# EAGLE design PSE project (EAGLE 9.6.2)
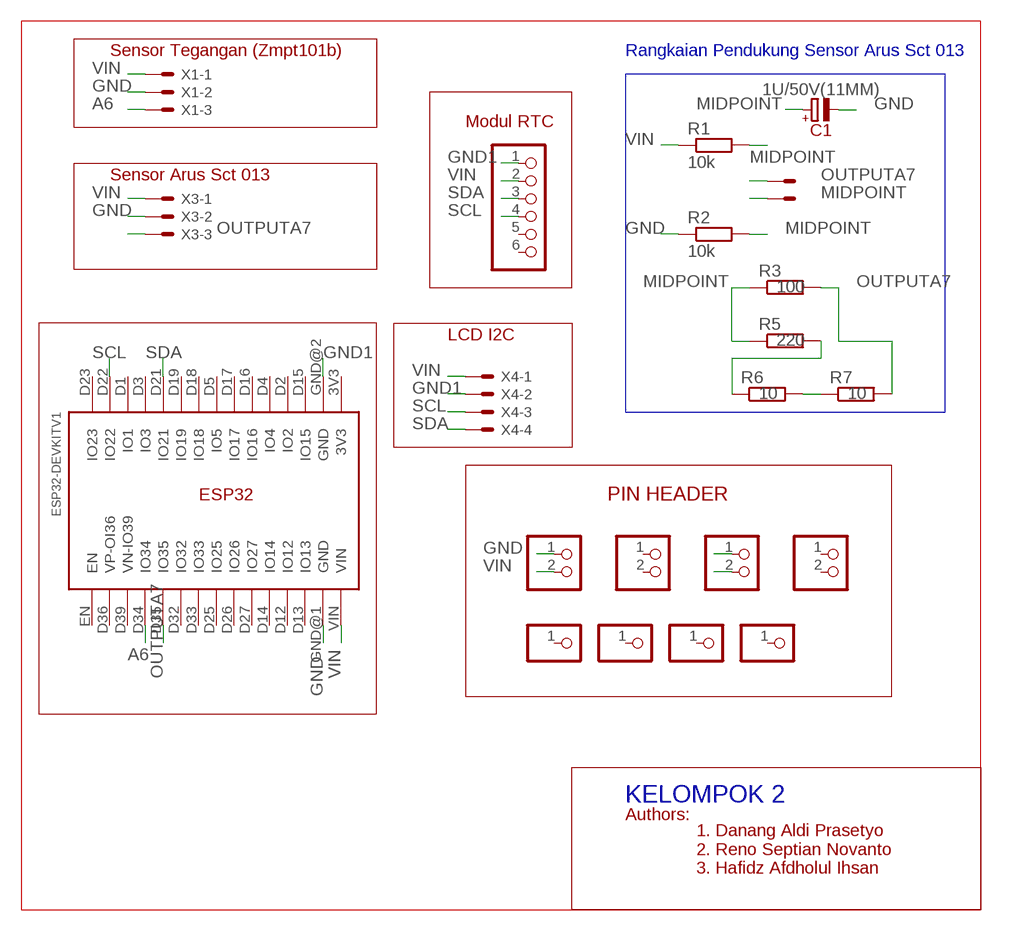
[diagram p0: schematic, sheet 1]

## Parts
C1  1U/50V(11MM)  [E2-5]
JP1  PINHD-1X2  [1X02]
JP2  PINHD-1X2  [1X02]
JP3  PINHD-1X2  [1X02]
JP4  PINHD-1X2  [1X02]
JP5  PINHD-1X6  [1X06]
JP6  PINHD-1X1  [1X01]
JP7  PINHD-1X1  [1X01]
JP8  PINHD-1X1  [1X01]
JP9  PINHD-1X1  [1X01]
R1  10k  R-EU_0204/5  [0204/5]
R2  10k  R-EU_0204/5  [0204/5]
R3  100  R-EU_0204/5  [0204/5]
R5  220  R-EU_0204/5  [0204/5]
R6  10  R-EU_0204/5  [0204/5]
R7  10  R-EU_0204/5  [0204/5]
U$1  ESP32DEVKITV1  [ESP32-DEVKITV1]
X1  JST-XH-03-PIN-LONG-PAD  [JST-XH-03-PACKAGE-LONG-PAD]
X3  JST-XH-03-PIN-LONG-PAD  [JST-XH-03-PACKAGE-LONG-PAD]
X4  JST-XH-04-PIN-LONG-PAD  [JST-XH-04-PACKAGE-LONG-PAD]
X7  JST-XH-02-PIN-LONG-PAD  [JST-XH-02-PACKAGE-LONG-PAD]

## Nets
A6: U$1.D34(IO34) X1.3
GND: C1.- JP1.1 R2.1 U$1.GND@1(GND) X1.2 X3.2
GND1: JP5.1 U$1.GND@2(GND) X4.2
MIDPOINT: C1.+ R1.2 R2.2 R3.1 R5.1 X7.2
N$1: R6.2 R7.1
N$2: R5.2 R6.1
N$16: JP2.1
N$17: JP2.2
OUTPUTA7: R3.2 R7.2 U$1.D35(IO35) X3.3 X7.1
SCL: JP5.4 U$1.D22(IO22) X4.3
SDA: JP5.3 U$1.D21(IO21) X4.4
VIN: JP1.2 JP5.2 R1.1 U$1.VIN X1.1 X3.1 X4.1
Unconnected: JP3.1 JP3.2 JP4.1 JP4.2 JP5.5 JP5.6 JP6.1 JP7.1 JP8.1 JP9.1 U$1.3V3 U$1.D1(IO1) U$1.D2(IO2) U$1.D3(IO3) U$1.D4(IO4) U$1.D5(IO5) U$1.D12(IO12) U$1.D13(IO13) U$1.D14(IO14) U$1.D15(IO15) U$1.D16(IO16) U$1.D17(IO17) U$1.D18(IO18) U$1.D19(IO19) U$1.D23(IO23) U$1.D25(IO25) U$1.D26(IO26) U$1.D27(IO27) U$1.D32(IO32) U$1.D33(IO33) U$1.D36(VP-OI36) U$1.D39(VN-IO39) U$1.EN

## Buses
B$1

## Notes on the sheet
- Sensor Tegangan (Zmpt101b) | Rangkaian Pendukung Sensor Arus Sct 013
- Modul RTC
- Sensor Arus Sct 013
- LCD I2C
- ESP32 | PIN HEADER
- KELOMPOK 2
- Authors:
- 1. Danang Aldi Prasetyo
  2. Reno Septian Novanto
  3. Hafidz Afdholul Ihsan

## Library data of the parts
C1 = capacitor:?; MOUSER: 647-UKW1H010MDD
JP1-JP4 = pinhead:PINHD-1X2: PIN HEADER
JP5 = pinhead:PINHD-1X6: PIN HEADER
JP6-JP9 = pinhead:PINHD-1X1: PIN HEADER
R1-R3 R5-R7 = resistor:R-EU_: RESISTOR, European symbol
U$1 = ESP32-DEVKITV1:ESP32DEVKITV1
X1 X3 = Rembrandt Electronics - JST XH Connectors v1-0:JST-XH-03-PIN: JST XH Connector 2 Pin Wire to board connector. Pitch: 2,54 mm, (0.100") Number of pins: 3 Created by Rembrandt Electronics www.rembrandtelectronics.com
X4 = Rembrandt Electronics - JST XH Connectors v1-0:JST-XH-04-PIN: JST XH Connector 2 Pin Wire to board connector. Pitch: 2,54 mm, (0.100") Number of pins: 4 Created by Rembrandt Electronics www.rembrandtelectronics.com
X7 = Rembrandt Electronics - JST XH Connectors v1-0:JST-XH-02-PIN: JST XH Connector 2 Pin Wire to board connector. Pitch: 2,54 mm, (0.100") Number of pins: 2 Created by Rembrandt Electronics www.rembrandtelectronics.com

## Board
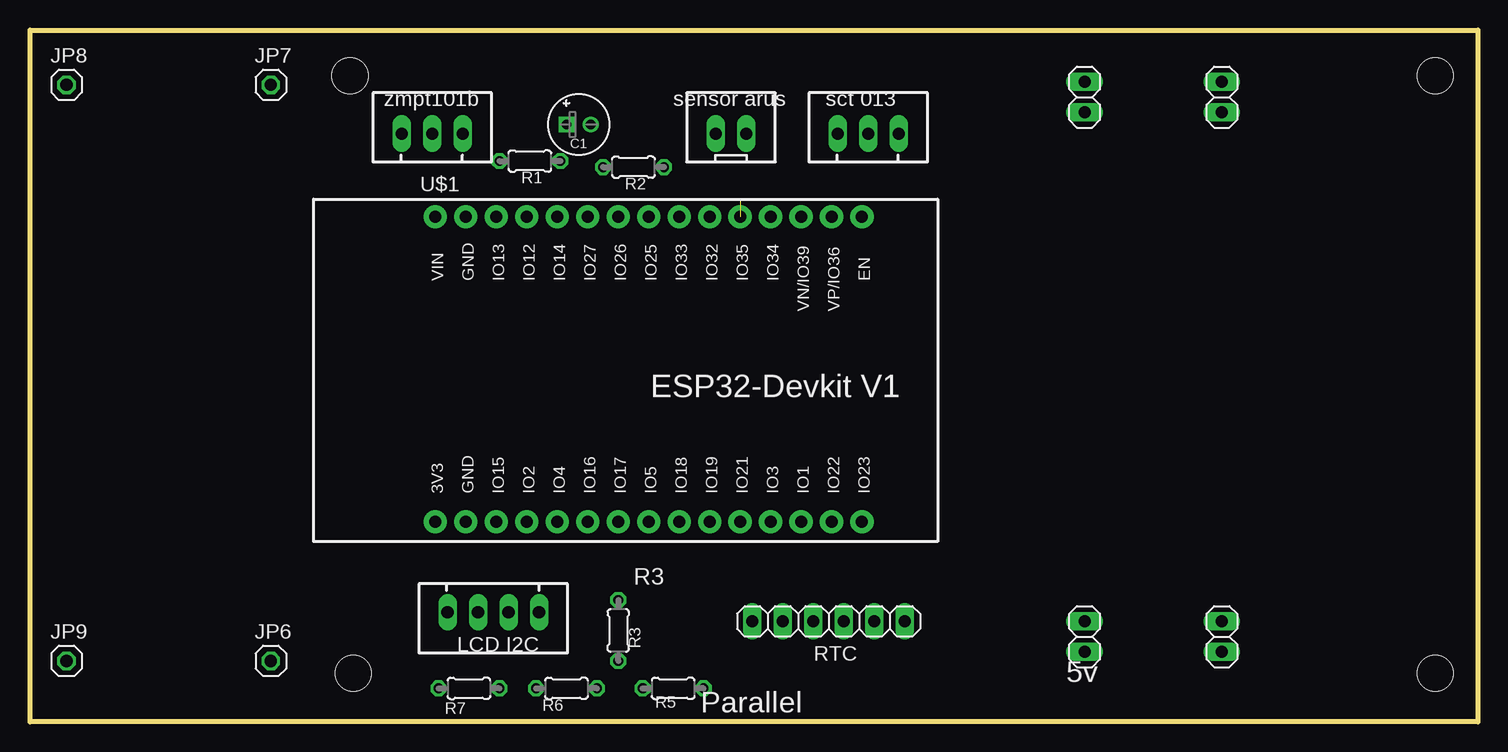
[diagram p1: board, top side]
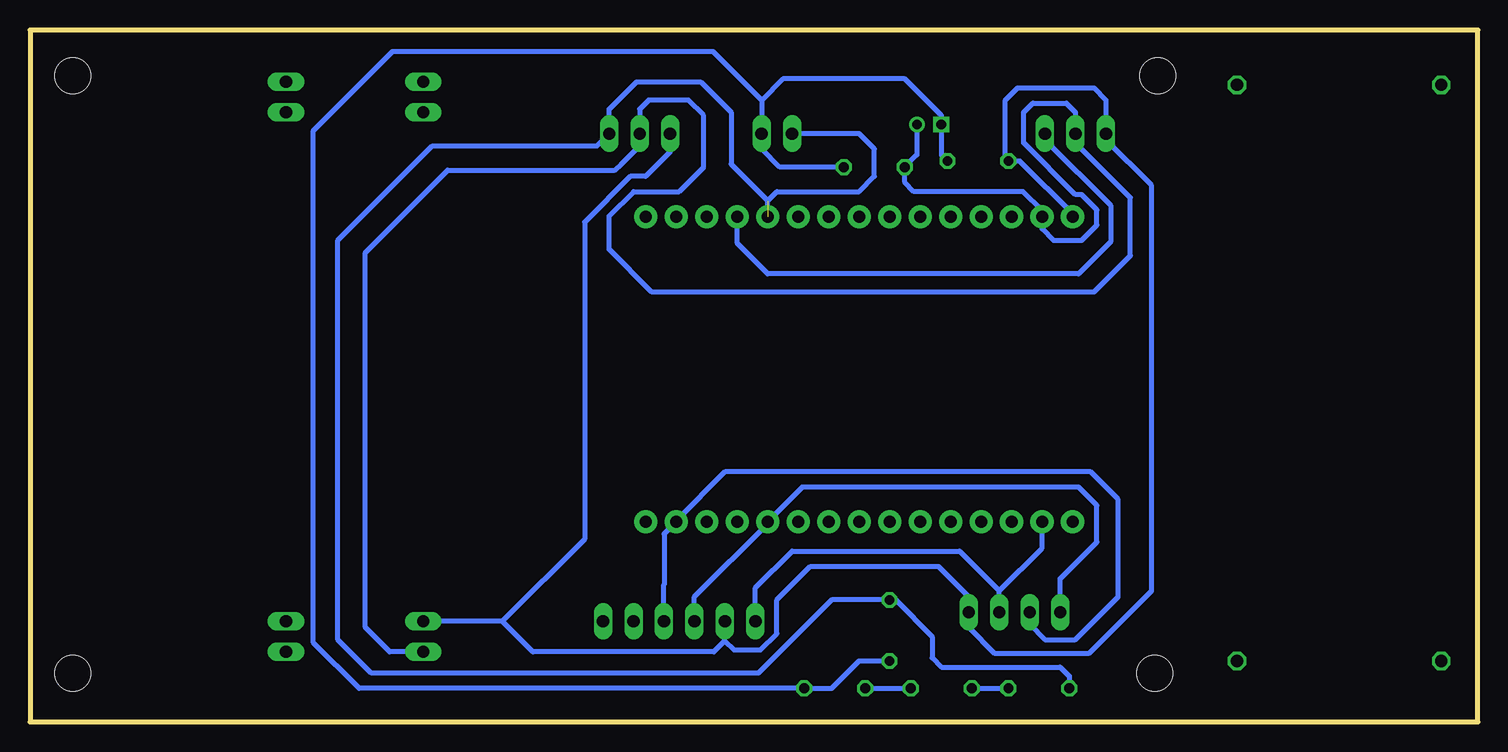
[diagram p2: board, bottom side, seen from below]

Size 120.65 x 57.66 mm. Coordinates in mm from the lower left corner, seen from the top.
Outline: 0,0 0,57.66 120.65,57.66 120.65,0 0,0
Copper layers (1*16): Top 0.035mm / dielectric 1.5mm / Bottom 0.035mm
Design rules "default": minimum track width 6mil, minimum drill 0.35mm, track to track 6mil, track to pad 6mil, pad to pad 6mil, via to via 6mil, smd to smd 6mil, copper to edge 40mil, drill to drill 6mil, minimum pad ring 10mil, minimum via ring 8mil, stop-mask expansion 4mil, vias tented up to drill 0mil, thermal gap 10mil
Holes 3 mm at 26.67,53.85 117.09,53.85 26.92,4.06 117.09,4.06

### Footprints (pad centres in the part's own frame; a part is rotated, then mirrored left to right if it is on the bottom)
E2-5 = drill 0.813 square: + -1.016,0 | drill 0.813: - 1.016,0
1X02 = drill 1.016 long: 1 -1.27,0; 2 1.27,0
1X06 = drill 1.016 long: 1 -6.35,0; 2 -3.81,0; 3 -1.27,0; 4 1.27,0; 5 3.81,0; 6 6.35,0
1X01 = drill 1.016 octagon: 1 0,0
0204/5 = drill 0.813 octagon: 1 -2.54,0; 2 2.54,0
ESP32-DEVKITV1 = drill 1 pad 1.93: 3V3 -16.52,-12.27; D1 13.96,-12.27; D2 -8.9,-12.27; D3 11.42,-12.27; D4 -6.36,-12.27; D5 1.26,-12.27; D12 -8.9,13.135; D13 -11.44,13.135; D14 -6.36,13.135; D15 -11.44,-12.27; D16 -3.82,-12.27; D17 -1.28,-12.27; D18 3.8,-12.27; D19 6.34,-12.27; D21 8.88,-12.27; D22 16.5,-12.27; D23 19.04,-12.27; D25 1.26,13.135; D26 -1.28,13.135; D27 -3.82,13.135; D32 6.34,13.135; D33 3.8,13.135; D34 11.42,13.135; D35 8.88,13.135; D36 16.5,13.135; D39 13.96,13.135; EN 19.04,13.135; GND@1 -13.98,13.135; GND@2 -13.98,-12.27; VIN -16.52,13.135
JST-XH-03-PACKAGE-LONG-PAD = drill 1.016 long: 1 -2.54,0; 2 0,0; 3 2.54,0
JST-XH-04-PACKAGE-LONG-PAD = drill 1.016 long: 1 -3.81,0; 2 -1.27,0; 3 1.27,0; 4 3.81,0
JST-XH-02-PACKAGE-LONG-PAD = drill 1.016 long: 1 -1.27,0; 2 1.27,0

### Placement (x,y rotation side)
C1  45.72,49.78 0 top
JP1  87.88,7.11 90 top
JP2  87.88,52.07 90 top
JP3  99.31,52.07 90 top
JP4  99.31,7.11 90 top
JP5  66.55,8.38 0 top
JP6  20.07,5.08 0 top
JP7  20.07,53.09 0 top
JP8  3.05,53.09 0 top
JP9  3.05,5.08 0 top
R1  41.66,46.74 0 top
R2  50.29,46.23 0 top
R3  49.02,7.62 90 top
R5  53.59,2.79 180 top
R6  44.7,2.79 180 top
R7  36.58,2.79 180 top
U$1  50.29,28.96 0 top
X1  33.53,49.02 0 top
X3  69.85,49.02 0 top
X4  38.61,9.14 180 top
X7  58.42,49.02 0 top

### Tracks (layer width: path | path; a pad name or v marks a point on that pad's centre or on a via)
A6
  Bottom 0.406: U$1.D34 61.71,39.87 59.18,37.34 33.27,37.34 30.61,40.01 30.61,43.05 36.07,48.51 X1.3
GND
  Bottom 0.406: C1.- 46.74,47.24 R2.1 47.75,44.96 46.99,44.2 37.91,44.2 36.31,42.6 U$1.GND@1 | 36.31,41.58 U$1.GND@1 | U$1.GND@1 36.31,41.08 35.37,40.13 33.02,40.13 31.75,41.4 31.75,42.67 33.02,43.94 33.53,43.94 37.85,48.26 37.85,50.8 37.08,51.56 34.29,51.56 33.53,50.8 X1.2 33.53,48.26 28.96,43.69 28.96,38.86 32,35.81 68.83,35.81 72.39,39.37 72.39,42.16 70.36,44.2 66.55,44.2 64.52,46.23 64.52,50.55 65.79,51.82 69.09,51.82 69.85,51.05 X3.2 69.85,48.01 71.32,46.53 71.35,46.53 71.91,45.97 85.85,45.97 92.71,39.12 92.71,7.87 90.68,5.84 JP1.1
GND1
  Bottom 0.406: U$1.GND@2 36.31,14.49 39.88,10.92 | X4.2 39.88,10.92 | JP5.1 60.2,11.18 57.15,14.22 43.18,14.22 39.88,10.92
MIDPOINT
  Bottom 0.406: R1.2 44.7,47.24 C1.+ 44.7,50.55 47.75,53.59 57.91,53.59 59.69,51.82 | 59.69,51.82 X7.2 59.69,47.75 58.17,46.23 R2.2 | 59.69,51.82 63.75,55.88 90.42,55.88 97.03,49.28 97.03,6.6 93.22,2.79 R5.1 53.85,2.79 51.56,5.08 R3.1
N$1
  Bottom 0.406: R6.2 R7.1
N$2
  Bottom 0.406: R5.2 R6.1
OUTPUTA7  (1 unrouted)
  Bottom 0.406: U$1.D35 59.17,43.44 58.42,44.2 51.56,44.2 50.29,45.47 50.29,47.75 51.56,49.02 X7.1 | 59.18,43.43 62.23,46.48 62.23,50.8 64.77,53.34 70.1,53.34 72.39,51.05 X3.3 73.41,48.01 87.12,48.01 95,40.13 95,6.86 92.2,4.06 59.94,4.06 53.85,10.16 R3.2 48.51,10.16 45.47,7.11 45.47,5.33 44.7,4.57 34.8,4.57 34.04,3.81 R7.2
SCL
  Bottom 0.406: JP5.4 67.82,11.43 67.81,11.44 67.81,15.67 U$1.D22 66.79,16.77 62.74,20.83 32.26,20.83 29.97,18.54 29.97,10.41 33.53,6.86 36.07,6.86 37.34,8.13 X4.3
SDA
  Bottom 0.406: JP5.3 65.28,10.41 59.17,16.52 U$1.D21 56.3,19.56 33.27,19.56 31.75,18.03 31.75,14.99 34.8,11.94 X4.4
VIN
  Bottom 0.406: 42.42,8.13 X4.1 | X4.1 42.42,7.87 40.28,5.74 32.36,5.74 27.18,10.92 27.18,44.7 30.99,48.51 X1.1 30.99,51.82 32,52.83 38.35,52.83 39.37,51.82 39.37,46.99 R1.1 38.16,46.74 33.77,42.34 U$1.VIN | 62.74,6.76 61.98,5.99 59.79,5.99 58.42,7.37 58.42,10.16 55.63,12.95 44.96,12.95 42.42,10.41 X4.1 | 62.74,6.76 JP5.2 | X3.1 67.31,47.5 69.34,45.47 70.61,45.47 74.42,41.66 74.42,15.24 81.28,8.38 | 62.74,6.76 63.65,5.84 78.74,5.84 81.28,8.38 | 81.28,8.38 JP1.2

### Text on the board
tPlace: Parallel
tNames: zmpt101b | sensor arus | sct 013 | R3 | LCD I2C | RTC | 5v